# EAGLE schematic Cooling (EAGLE 7.6.0)
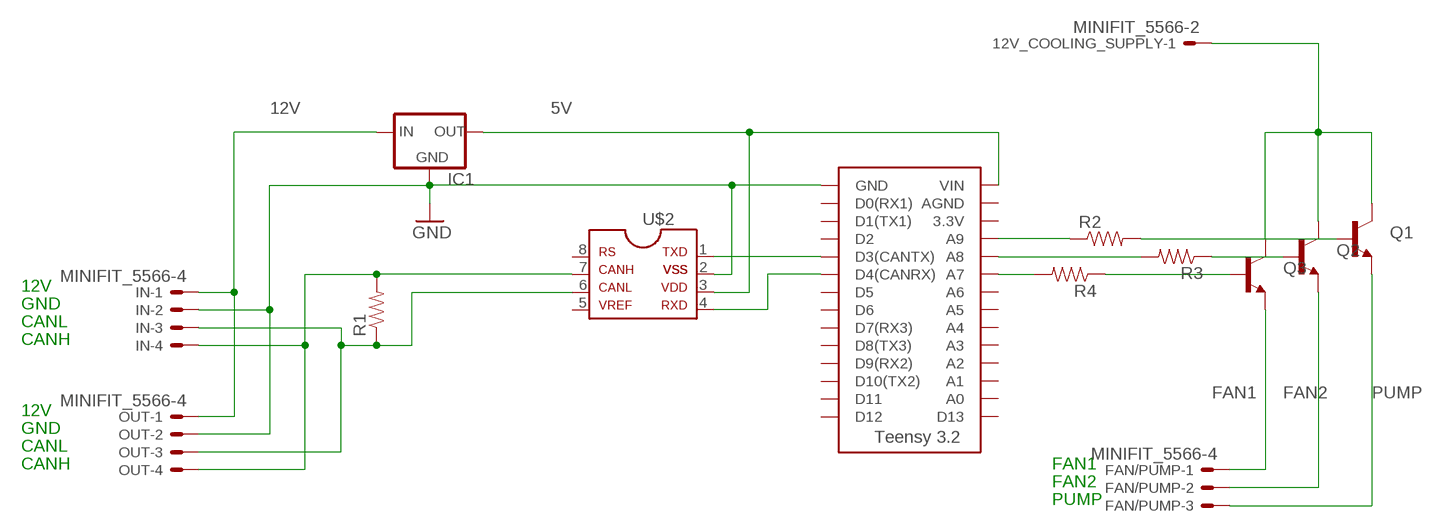
[diagram p0: schematic, sheet 1]

## Parts
12V_COOLING_SUPPLY  MINIFIT_5566-2  [MINIFIT_5566-2]
FAN/PUMP  MINIFIT_5566-4  [MINIFIT_5566-4]
IC1  5V_REGULATOR_LM340-NLM340MPX-5.0/NOPB  [SOT223]
IN  MINIFIT_5566-4  [MINIFIT_5566-4]
OUT  MINIFIT_5566-4  [MINIFIT_5566-4]
Q1  BJT_NPNTIP120(SINK)  [TO-220-SINK]
Q2  BJT_NPNTIP120(SINK)  [TO-220-SINK]
Q3  BJT_NPNTIP120(SINK)  [TO-220-SINK]
R1  RESISTOR0805-RES  [0805]
R2  RESISTOR0805-RES  [0805]
R3  RESISTOR0805-RES  [0805]
R4  RESISTOR0805-RES  [0805]
U$1  TEENSY_3.2_SIMPLE  [TEENSY_3.2_SIMPLE]
U$2  MCP2551SOIC  [SOIC08]

## Nets
5V: U$1.VIN U$2.3
12V: IC1.3(IN) IN.1 OUT.1
12V_COOLING_SUPPLY: 12V_COOLING_SUPPLY.1 Q1.2(COLLECTOR) Q2.2(COLLECTOR) Q3.2(COLLECTOR)
FAN1: FAN/PUMP.1 Q3.3(EMITTER)
FAN2: FAN/PUMP.2 Q2.3(EMITTER)
GND: IC1.1(GND) IN.2 OUT.2 U$1.GND U$2.2
N$1: R4.2 U$1.A7
N$2: U$1.D3(CANTX) U$2.1
N$3: U$1.D4(CANRX) U$2.4
N$5: U$2.6
N$6: Q3.1(BASE) R4.1
N$7: Q1.1(BASE) R2.2
N$8: IN.3 OUT.3 R1.1
N$9: R2.1 U$1.A9
N$11: IN.4 OUT.4 R1.2 U$2.7
N$12: R3.2 U$1.A8
N$17: Q2.1(BASE) R3.1
PUMP: FAN/PUMP.3 Q1.3(EMITTER)
Unconnected: 12V_COOLING_SUPPLY.2 FAN/PUMP.4 IC1.2(OUT) IC1.4(OUT) U$1.3.3V U$1.A0 U$1.A1 U$1.A2 U$1.A3 U$1.A4 U$1.A5 U$1.A6 U$1.AGND U$1.D0(RX1) U$1.D1(TX1) U$1.D2 U$1.D5 U$1.D6 U$1.D7(RX3) U$1.D8(TX3) U$1.D9(RX2) U$1.D10(TX2) U$1.D11 U$1.D12 U$1.D13 U$2.5 U$2.8

## Notes on the sheet
- 12V
- GND
- CANL
- CANH
- 12V
- GND
- CANL
- CANH | FAN1
- FAN2
- PUMP

## Library data of the parts
12V_COOLING_SUPPLY = HyTechDevices:MINIFIT_5566-2: Mini FIT Junior connector 2 pole Source: http://www.molex.com; OC_FARNELL: 1822072; OC_NEWARK: unknown
FAN/PUMP IN OUT = HyTechDevices:MINIFIT_5566-4: Mini FIT Junior connector 4 pole Source: http://www.molex.com; OC_FARNELL: unknown; OC_NEWARK: unknown
IC1 = HyTechDevices:5V_REGULATOR_LM340-N: Voltage Regulator 5v linear voltage regulator Datasheet <http://www.mouser.com/ProductDetail/Texas-Instruments/LM340MPX-50-NOPB/?qs=X1J7HmVL2ZGZwtTFRQ9ItA%3D%3D> MAX current out: 1.5A MAX voltage in: 35V
Q1-Q3 = HyTechDevices:BJT_NPN: Generic NPN BJT MMBT2222A - TRANS-08049 (SOT-23, 1A 40V) MPSA42 - TRANS-09116 (SOT-23, 500mA 300V) MMBT5088LT1G - TRANS-11160 (SOT-23, 50 mA 30V) BC547 - COM-08928 <http://www.sparkfun.com/products/8928> (TO-92 45V 100mA) (1.Collector 2.Base 3.Emitter) 2N3904 - COM-00521 <http://www.sparkfun.com/products/521> (TO-92 40V 200mA) (1.Emitter 2.Base 3.Collector) P2N2222A - COM-12852 <http://www.sparkfun.com/products/12852> (TO-92 40V 600mA) (1.Collector 2.Base 3.Emitter) Source: Sparkfun <https://github.com/sparkfun/SparkFun-Eagle-Libraries>
R1-R4 = HyTechDevices:RESISTOR: Resistor Basic schematic elements and footprints for 0603, 1206, and PTH resistors.
U$1 = HyTechDevices:TEENSY_3.2_SIMPLE: Simple version of the Teensy 3.2 board that only uses the 2 main rows of pins, not the inner pins or the pins opposite the usb port.
U$2 = HyTechDevices:MCP2551: MCP2551 High-Speed CAN Transceiver Product Webpage <https://www.microchip.com/wwwproducts/en/MCP2551> Datasheet <http://ww1.microchip.com/downloads/en/DeviceDoc/21667f.pdf> This device is outdated It is replaced by MCP2561. Comparison Page <https://www.microchip.com/wwwproducts/ProductCompare/MCP2551/MCP2561> Product Webpage <https://www.microchip.com/wwwproducts/en/MCP2561> Datasheet <http://ww1.microchip.com/downloads/en/DeviceDoc/20005167C.pdf>